# Altium schematic sheet LCD.SchDoc
size A4
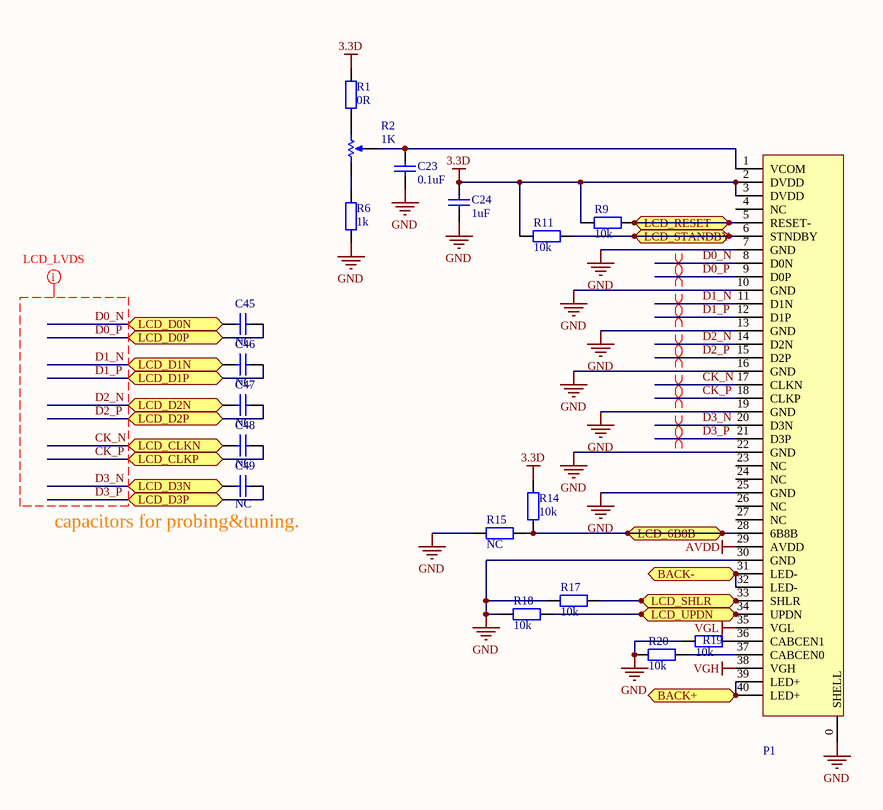
[diagram p0: LCD.SchDoc]

## Parts
C23  0.1uF  [0402]
C24  1uF  [0402]
C45  NC  [0402]
C46  NC  [0402]
C47  NC  [0402]
C48  NC  [0402]
C49  NC  [0402]
P1  LCD_40P_LVDS  [FPC-0.5mm-40]  (value not drawn)
R1  0R  [0402]
R2  value 1K  [POT1]  (hidden comment: RPot)
R6  1k  [0402]
R9  10k  [0402]
R11  10k  [0402]
R14  10k  [0402]
R15  NC  [0402]
R17  10k  [0402]
R18  10k  [0402]
R19  10k  [0402]
R20  10k  [0402]

## Ports
BACK+, BACK-, LCD_6B8B, LCD_CLKN, LCD_CLKP, LCD_D0N, LCD_D0P, LCD_D1N, LCD_D1P, LCD_D2N, LCD_D2P, LCD_D3N, LCD_D3P, LCD_RESET, LCD_SHLR, LCD_STANDBY, LCD_UPDN

## Nets
3.3D: C24.1 P1.2(DVDD) P1.3(DVDD) R1.2 R9.1 R11.1 R14.2
AVDD: P1.29(AVDD)
GND: C23.2 C24.2 P1.0(SHELL) P1.7(GND) P1.10(GND) P1.13(GND) P1.16(GND) P1.19(GND) P1.22(GND) P1.25(GND) P1.30(GND) R6.1 R15.1 R17.1 R18.1 R19.1 R20.1
VGH: P1.38(VGH)
VGL: P1.35(VGL)
BACK+: P1.39(LED+) P1.40(LED+) ; port BACK+
BACK-: P1.31(LED-) P1.32(LED-) ; port BACK-
CK_N: C48.1 P1.17(CLKN) ; port LCD_CLKN
CK_P: C48.2 P1.18(CLKP) ; port LCD_CLKP
D0_N: C45.1 P1.8(D0N) ; port LCD_D0N
D0_P: C45.2 P1.9(D0P) ; port LCD_D0P
D1_N: C46.1 P1.11(D1N) ; port LCD_D1N
D1_P: C46.2 P1.12(D1P) ; port LCD_D1P
D2_N: C47.1 P1.14(D2N) ; port LCD_D2N
D2_P: C47.2 P1.15(D2P) ; port LCD_D2P
D3_N: C49.1 P1.20(D3N) ; port LCD_D3N
D3_P: C49.2 P1.21(D3P) ; port LCD_D3P
LCD_6B8B: P1.28(6B8B) R14.1 R15.2 ; port LCD_6B8B
LCD_RESET: P1.5(RESET-) R9.2 ; port LCD_RESET
LCD_SHLR: P1.33(SHLR) R17.2 ; port LCD_SHLR
LCD_STANDBY: P1.6(STNDBY) R11.2 ; port LCD_STANDBY
LCD_UPDN: P1.34(UPDN) R18.2 ; port LCD_UPDN
NetC23_1: C23.1 P1.1(VCOM) R2.3(TAP)
NetP1_36: P1.36(CABCEN1) R19.2
NetP1_37: P1.37(CABCEN0) R20.2
NetR1_1: R1.1 R2.2(BOT)
NetR2_1: R2.1(TOP) R6.2

Not connected (* = marked no-connect by the designer): P1 4(NC) 23(NC) 24(NC) 26(NC) 27(NC)

## Layout directives
differential pair: CK_N, CK_P, D0_N, D0_P, D1_N, D1_P, D2_N, D2_P, D3_N, D3_P
net class LCD_LVDS: CK_N, CK_P, D0_N, D0_P, D1_N, D1_P, D2_N, D2_P, D3_N, D3_P

## Notes on the sheet
- (near C49) capacitors for probing&tuning.

## Library data of the parts
C23 C24 C45-C49 = Cap: Capacitor; Published: 8-Jun-2000; LatestRevisionDate: 17-Jul-2002; LatestRevisionNote: Re-released for DXP Platform.; PackageReference: RAD-0.3; Publisher: Altium Limited; PackageDescription: Radial Cap, Thru-Hole; 2 Leads; 0.3 in Pin Spacing
R1 R6 R9 R11 R14 R15 R17-R20 = Res2: Resistor; Published: 8-Jun-2000; LatestRevisionDate: 17-Jul-2002; LatestRevisionNote: Re-released for DXP Platform.; PackageReference: AXIAL-0.4; Publisher: Altium Limited; PackageDescription: Axial Device, Thru-Hole; 2 Leads; 0.4 in Pin Spacing
R2 = RPot: Potentiometer; Sim Note: Enter the Resistance value and the set point into parameter fields.; Set Position: 0.5; Published: 8-Jun-2000; LatestRevisionDate: 17-Jul-2002; LatestRevisionNote: Re-released for DXP Platform.; PackageReference: VR5; Publisher: Altium Limited; PackageDescription: Variable Resistor, Thru-Hole; 3 Leads